# Altium schematic sheet PWR.SchDoc
size A; SheetNumber: 2; SheetTotal: 5
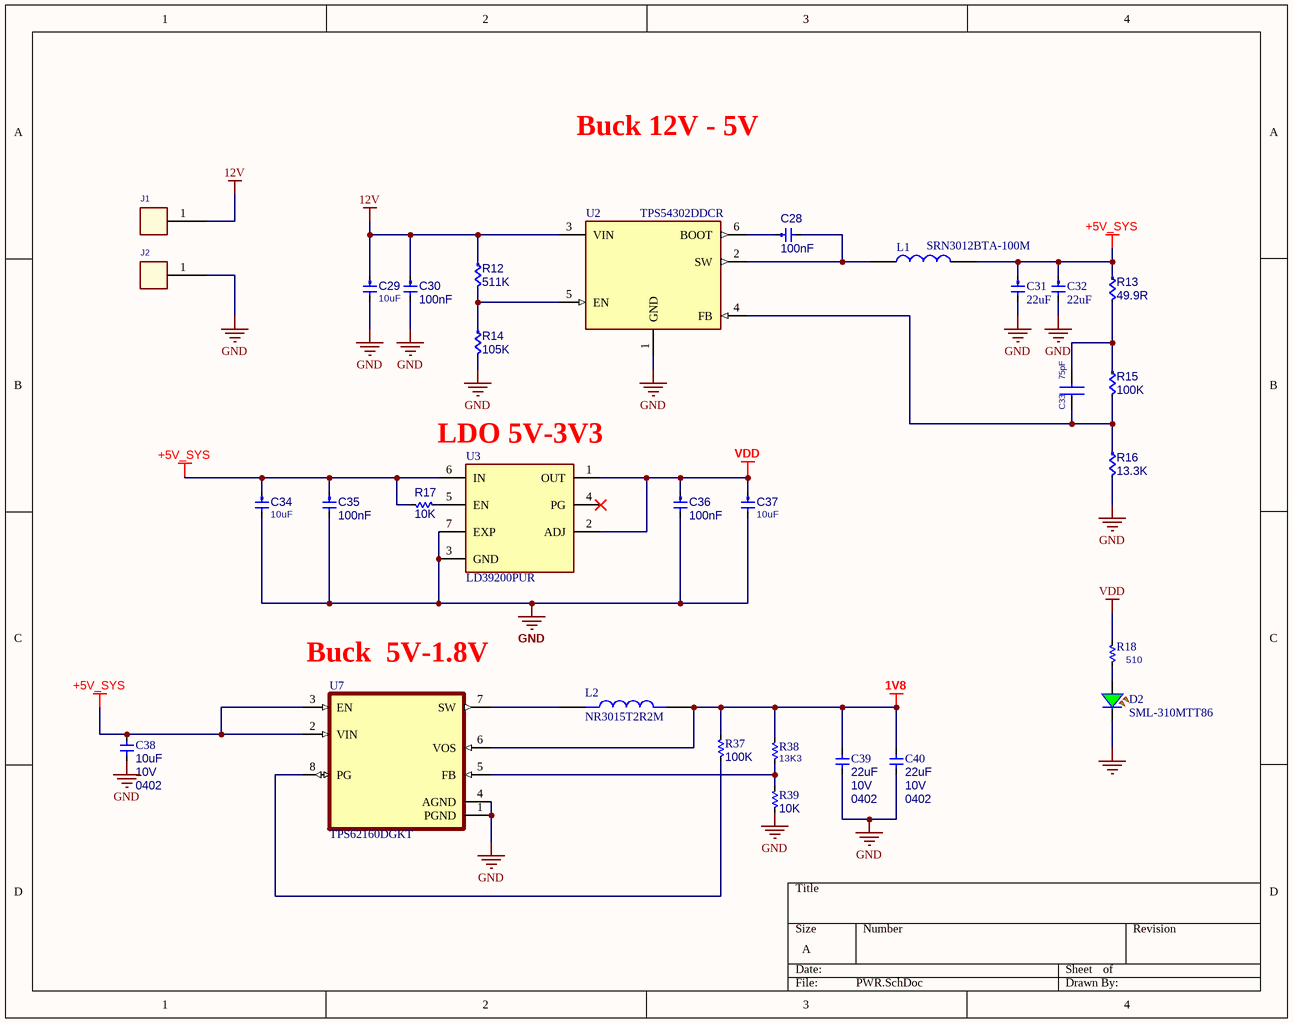
[diagram p0: PWR.SchDoc]

## Parts
C28  Capacitance: 100nF  [CAP0402]  (hidden comment: CC0402KRX5R9BB104)
C29  Capacitance: 10uF  [CAP0603]  (hidden comment: GRM188R6YA106MA73D)
C30  Capacitance: 100nF  [CAP0402]  (hidden comment: CC0402KRX5R9BB104)
C31  Capacitance: 22uF  [CAP0402]  (hidden comment: GRM158R61A226ME15D)
C32  Capacitance: 22uF  [CAP0402]  (hidden comment: GRM158R61A226ME15D)
C33  75pF  [CAP0402]
C34  Capacitance: 10uF  [CAP0603]  (hidden comment: GRM188R6YA106MA73D)
C35  Capacitance: 100nF  [CAP0402]  (hidden comment: CC0402KRX5R9BB104)
C36  Capacitance: 100nF  [CAP0402]  (hidden comment: CC0402KRX5R9BB104)
C37  Capacitance: 10uF  [CAP0603]  (hidden comment: GRM188R6YA106MA73D)
C38  value 10uF  Voltage: 10V  Package: 0402  [CAP0402]  (hidden comment: CAP0402 10uF 10V)
C39  value 22uF  Voltage: 10V  Package: 0402  [CAP0402]  (hidden comment: CAP0402 22uF 10V)
C40  value 22uF  Voltage: 10V  Package: 0402  [CAP0402]  (hidden comment: CAP0402 22uF 10V)
D2  SML-310MTT86  [LED0603 GREEN]
J1  CON1  [ESC PAD 3X4]  (value not drawn)
J2  CON1  [ESC PAD 3X4]  (value not drawn)
L1  SRN3012BTA-100M  [SRN3012BTA-100M]
L2  NR3015T2R2M  [IND_NR3015T2R2M]
R12  511K  [RES0402]
R13  49.9R  [RES0402]
R14  105K  [RES0402]
R15  100K  [RES0402]
R16  13.3K  [RES0402]
R17  value 10K  [RES0402]  (hidden comment: RES0402 10K)
R18  value 510  [RES0402]  (hidden comment: RES0402)
R37  value 100K  [RES0402]  (hidden comment: RES0402 100K)
R38  value 13K3  [RES0402]  (hidden comment: RES0402 13K3)
R39  value 10K  [RES0402]  (hidden comment: RES0402 10K)
U2  TPS54302DDCR  [SOT95P280X110-6N - duplicate1]
U3  LD39200PUR  [LD39200PUR]
U7  TPS62160DGKT  [SOP65P490X110-8N]

## Nets
1V8: C39.2 C40.2 L2.2 R37.2 R38.2 U7.6(VOS)
12V: C29.1 C30.1 J1.1 R12.1 U2.3(VIN)
+5V_SYS: C31.1 C32.1 C34.1 C35.1 C38.2 L1.2 R13.1 R17.2 U3.6(IN) U7.2(VIN) U7.3(EN)
GND: C29.2 C30.2 C31.2 C32.2 C34.2 C35.2 C36.2 C37.2 C38.1 C39.1 C40.1 D2.1 J2.1 R14.2 R16.2 R39.1 U2.1(GND) U3.3(GND) U3.7(EXP) U7.1(PGND) U7.4(AGND)
VDD: C36.1 C37.1 R18.1 U3.1(OUT) U3.2(ADJ)
NetC28_1: C28.1 U2.6(BOOT)
NetC28_2: C28.2 L1.1 U2.2(SW)
NetC33_1: C33.1 R15.2 R16.1 U2.4(FB)
NetC33_2: C33.2 R13.2 R15.1
NetD2_2: D2.2 R18.2
NetL2_1: L2.1 U7.7(SW)
NetR12_2: R12.2 R14.1 U2.5(EN)
NetR17_1: R17.1 U3.5(EN)
NetR37_1: R37.1 U7.8(PG)
NetR38_1: R38.1 R39.2 U7.5(FB)

Not connected (* = marked no-connect by the designer): U3 4(PG)*

## Notes on the sheet
- Buck 12V - 5V
- (near U3) LDO 5V-3V3
- (near U7) Buck  5V-1.8V

## Library data of the parts
C28 C30 C35 C36 = CMP-00265-1: CAP CER 0.1UF 50V X5R 0402; Manufacturer: Yageo; Tolerance: 10%; Voltage Rating: 50V; Dielectric: X5R; Width: 0.02inch; Thickness: 0.022inch; Packaging: Tape and Reel; Length: 0.039inch; Mount: Surface Mount; Case/Package: 0402; Min Operating Temperature: -55°C; Halogen Free: Halogen Free; Voltage Rating (DC): 50V; Manufacturer Part Number: CC0402KRX5R9BB104; Max Operating Temperature: 85°C; Lead Free: Lead Free; Manufacturer 1: Yageo; Manufacturer Part Number 1: CC0402KRX5R9BB104
C29 C34 C37 = CMP-01031-1: CAP CER 10UF 35V X5R 0603; Manufacturer 1: Murata Electronics; Tolerance: 20%; Case/Package: 0603; Depth: 0.8mm; Composition: Ceramic; Length: 1.6mm; Max Operating Temperature: 85°C; Lead Free: Lead Free; Thickness: 0.031inch; Number of Pins: 2; Weight: 0.000222oz; Min Operating Temperature: -55°C; REACH SVHC: No SVHC; Case Code (Metric): 1608; Termination: SMD/SMT; Packaging: Tape and Reel; Height: 0.8mm; Voltage Rating (DC): 35V; Width: 0.031inch; Voltage Rating: 35V; Manufacturer Part Number 1: GRM188R6YA106MA73D; Mount: Surface Mount; Package Quantity: 1; Case Code (Imperial): 0603; Dielectric: X5R; Voltage: 35V
C31 C32 = CMP-00520-1: CAP CER 22UF 10V X5R 0402; Manufacturer 1: TDK Corporation; Tolerance: 10%; Case Code (Imperial): 0402; Case/Package: 0402; Voltage: 10V; Min Operating Temperature: -55°C; Termination: SMD/SMT; Voltage Rating: 10V; Length: 1mm; REACH SVHC: No SVHC; Max Operating Temperature: 85°C; Radiation Hardening: No; Depth: 0.5mm; Case Code (Metric): 1005; Dielectric: X5R; Manufacturer Part Number 1: GRM158R61A226ME15D; Packaging: Tape and Reel
C33 = CAP_Dup1_16: CAP CER 75PF 25V C0G/NP0 0402; Manufacturer PN: CC0402JRNPO9BN750; Manufacturer: YAGEO; PART_NUMBER: TMP-416; CLASS: DISCRETE; Tolerance: 5%; Temperature Coefficient: C0G, NP0; Dielectric Type: Capacitors; Rated Voltage: 25V; Package Size: 0402 (1005 Metric)
C38 = CAP0402 10uF 10V: Cap 10uF 10V 0402; MP: GRT155R61A106ME13D
C39 C40 = CAP0402 22uF 10V: Cap 22uF 10V 0402; MP: GRM158R61A226ME15D
D2 = CMP-01130-2: LED GREEN CLEAR 0603 SMD; Manufacturer 1: Rohm Semiconductor; Luminous Intensity: 16mcd; Wavelength: 570nm; Number of LEDs: 1; Color: Green,Yellow; Forward Voltage: 2.2V; Lens Color: Colorless,Clear; Forward Current: 20mA; Viewing Angle: 140°; Lens Style: Rectangular,Clear,Diffused,Colorless; Case Code (Imperial): 0603; Lens Transparency: Clear; Package Quantity: 3000; Width: 0.8mm; Manufacturer Part Number 1: SML-310MTT86; Min Operating Temperature: -30°C; Length: 1.6mm; Packaging: Tape and Reel; Dominant Wavelength: 570nm; Height: 0.9mm; Radiation Hardening: No; Test Current: 20mA; Case Code (Metric): 1608; Lead Free: Lead Free; Case/Package: 0603; Mount: Surface Mount; Max Operating Temperature: 85°C; Illumination Color: Green; Number of Pins: 2
J1 J2 = CON1: SOLDER PADS
L1 = SRN3012BTA-330M: 10uH; Manufacturer_Name: Bourns; Geometry.Height: 1.2mm; Mouser Part Number: SRN3012BTA-100M; Mouser Price/Stock: https://www.mouser.co.uk/ProductDetail/Bourns/SRN3012BTA-330M?qs=Imq1NPwxi74rPoSZ4PPaRw%3D%3D; Manufacturer_Part_Number: SRN3012BTA-100M; Datasheet Link: https://www.bourns.com/docs/Product-Datasheets/SRN3012BTA.pdf
L2 = NR3015T2R2M: 2.2 ÂµH Shielded Drum Core, Wirewound Inductor 1.5 A 72mOhm Max Nonstandard; MF: Taiyo Yuden; MP: NR3015T2R2M; Price: None; Purchase-URL: https://pricing.snapeda.com/search/part/NR3015T2R2M/?ref=eda; Package: Nonstandard Taiyo Yuden; Check_prices: https://www.snapeda.com/parts/NR3015T2R2M/Taiyo+Yuden/view-part/?ref=eda; Value: *; Availability: In Stock; SnapEDA_Link: https://www.snapeda.com/parts/NR3015T2R2M/Taiyo+Yuden/view-part/?ref=snap
R12 = CMP-00299-1_1: RES SMD 511K OHM 1% 1/16W 0402; Manufacturer: Yageo; Manufacturer Part Number: RC0402FR-07511KL; Temperature Coefficient: 100ppm/°C; Working Voltage: 50V; Max Power Dissipation: 63mW; Power Rating: 62.5mW; Height: 0.016inch; Package Quantity: 1; Min Operating Temperature: -55°C; Tolerance: 1%; Military Standard: Not; Packaging: Tape and Reel; Number of Terminations: 2; Width: 0.02inch; Case/Package: 0402; Length: 1mm; Voltage Rating (DC): 50V; Case Code (Metric): 1005; Resistance: 511K; Composition: Thick Film; Voltage Rating: 50V; Max Operating Temperature: 155°C; Case Code (Imperial): 0402; Lead Free: Lead Free; Termination: SMD/SMT; Features: Moisture Resistant; Depth: 0.5mm; Manufacturer 1: Yageo; Manufacturer Part Number 1: RC0402FR-07511KL
R13 = CMP-00299-1_1: RES SMD 49.9R OHM 1% 1/16W 0402; Manufacturer: Yageo; Manufacturer Part Number: RC0402FR-0749R9L; Temperature Coefficient: 100ppm/°C; Working Voltage: 50V; Max Power Dissipation: 63mW; Power Rating: 62.5mW; Height: 0.016inch; Package Quantity: 1; Min Operating Temperature: -55°C; Tolerance: 1%; Military Standard: Not; Packaging: Tape and Reel; Number of Terminations: 2; Width: 0.02inch; Case/Package: 0402; Length: 1mm; Voltage Rating (DC): 50V; Case Code (Metric): 1005; Resistance: 49.9R; Composition: Thick Film; Voltage Rating: 50V; Max Operating Temperature: 155°C; Case Code (Imperial): 0402; Lead Free: Lead Free; Termination: SMD/SMT; Features: Moisture Resistant; Depth: 0.5mm; Manufacturer 1: Yageo; Manufacturer Part Number 1: RC0402FR-0749R9L
R14 = CMP-00299-1_1: RES SMD 105K OHM 1% 1/16W 0402; Manufacturer: Yageo; Manufacturer Part Number: RC0402FR-07105KL; Temperature Coefficient: 100ppm/°C; Working Voltage: 50V; Max Power Dissipation: 63mW; Power Rating: 62.5mW; Height: 0.016inch; Package Quantity: 1; Min Operating Temperature: -55°C; Tolerance: 1%; Military Standard: Not; Packaging: Tape and Reel; Number of Terminations: 2; Width: 0.02inch; Case/Package: 0402; Length: 1mm; Voltage Rating (DC): 50V; Case Code (Metric): 1005; Resistance: 105K; Composition: Thick Film; Voltage Rating: 50V; Max Operating Temperature: 155°C; Case Code (Imperial): 0402; Lead Free: Lead Free; Termination: SMD/SMT; Features: Moisture Resistant; Depth: 0.5mm; Manufacturer 1: Yageo; Manufacturer Part Number 1: RC0402FR-07105KL
R15 = CMP-00299-1_1: RES SMD 100K OHM 1% 1/16W 0402; Manufacturer: Yageo; Manufacturer Part Number: RC0402FR-0749R9L; Temperature Coefficient: 100ppm/°C; Working Voltage: 50V; Max Power Dissipation: 63mW; Resistance: 49.9R; Power Rating: 62.5mW; Height: 0.016inch; Package Quantity: 1; Min Operating Temperature: -55°C; Tolerance: 1%; Military Standard: Not; Packaging: Tape and Reel; Number of Terminations: 2; Width: 0.02inch; Case/Package: 0402; Length: 1mm; Voltage Rating (DC): 50V; Case Code (Metric): 1005; Composition: Thick Film; Voltage Rating: 50V; Max Operating Temperature: 155°C; Case Code (Imperial): 0402; Lead Free: Lead Free; Termination: SMD/SMT; Features: Moisture Resistant; Depth: 0.5mm; Manufacturer 1: Yageo; Manufacturer Part Number 1: RC0402FR-0749R9L
R16 = CMP-00299-1_1: RES SMD 13.3K OHM 1% 1/16W 0402; Manufacturer: Yageo; Manufacturer Part Number: RC0402FR-0749R9L; Temperature Coefficient: 100ppm/°C; Working Voltage: 50V; Max Power Dissipation: 63mW; Resistance: 49.9R; Power Rating: 62.5mW; Height: 0.016inch; Package Quantity: 1; Min Operating Temperature: -55°C; Tolerance: 1%; Military Standard: Not; Packaging: Tape and Reel; Number of Terminations: 2; Width: 0.02inch; Case/Package: 0402; Length: 1mm; Voltage Rating (DC): 50V; Case Code (Metric): 1005; Composition: Thick Film; Voltage Rating: 50V; Max Operating Temperature: 155°C; Case Code (Imperial): 0402; Lead Free: Lead Free; Termination: SMD/SMT; Features: Moisture Resistant; Depth: 0.5mm; Manufacturer 1: Yageo; Manufacturer Part Number 1: RC0402FR-0749R9L
R17 R39 = RES0402 10K: RES 10K 0402; MP: RC0402FR-0710KL
R18 = RES0402: RES 0402; MP: add later
R37 = RES0402 100K: RES 100K 0402; MP: RC0402FR-07100KL
R38 = RES0402 13K3: RES 13K3 0402; MP: RC0402FR-0713K3L
U2 = TPS54302DDCR: 4.5-V to 28-V Input, 3-A Output, EMI Friendly Synchronous Step-Down Converter; MF: Texas Instruments; Package: SOT-23-THN-6 Texas Instruments; Price: None; Check_prices: https://www.snapeda.com/parts/TPS54302DDCR/Texas+Instruments/view-part/?ref=eda; Value: *; SnapEDA_Link: https://www.snapeda.com/parts/TPS54302DDCR/Texas+Instruments/view-part/?ref=snap; MP: TPS54302DDCR; Availability: In Stock; Purchase-URL: https://pricing.snapeda.com/search?q=TPS54302DDCR&ref=eda
U3 = LD39200PUR: LDO IC 1 Output 2A 6-DFN _3x3_; MF: STMicroelectronics; Package: DFN-6 STMicroelectronics; Availability: Unavailable; MP: LD39200PUR; Value: *; SnapEDA_Link: https://www.snapeda.com/parts/LD39200PUR/STMicroelectronics/view-part/882017/?ref=snap; Price: None
U7 = TPS62160DGKT: 3V-17V 1A Step-Down Converters with DCS-Controlâ„¢; MF: Texas Instruments; SnapEDA_Link: https://www.snapeda.com/parts/TPS62160DGKT/Texas+Instruments/view-part/?ref=snap; Package: VSSOP-8 Texas Instruments; Value: *; MP: TPS62160DGKT; Check_prices: https://www.snapeda.com/parts/TPS62160DGKT/Texas+Instruments/view-part/?ref=eda